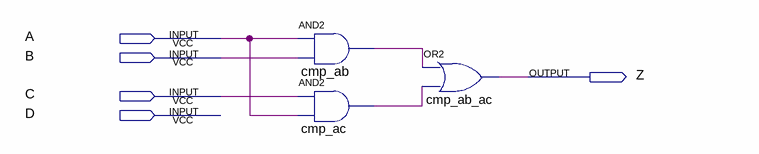
[diagram p0: schematic sheet]
// Quartus schematic compare.bdf as structural Verilog: 3 symbols, 5 pins
module compare (
  input  A,
  input  B,
  input  C,
  input  D,
  output Z
);

  wire cmp_ab_out, cmp_ac_out;

  and cmp_ab (cmp_ab_out, A, B);
  and cmp_ac (cmp_ac_out, C, A);
  or cmp_ab_ac (Z, cmp_ab_out, cmp_ac_out);
endmodule
